# Altium schematic sheet HeaderA.SchDoc: HPBI Controller
size B; ApprovedBy: J Johnson; CheckedBy: J Johnson; Author: sdfasdfdfAEFfasdFfaF; DrawnBy: J Johnson; Organization: Opsero Electronic Design; Address1: 21-915 Av. Marguerite-Bourgeoys; Address2: Québec (QC); Address3: G1S 3X4; DocumentNumber: OP009-001-SCH; Revision: 1.0; SheetNumber: 09; SheetTotal: 16; Tel1: (581) 308-8830; Tel2: (581) 308-8830; Project: HPBI Controller; CheckedDate: yyyy-mm-dd; Sheet: Header A; PageSetup: Record=PageOptions|CenterHorizontal=True|CenterVertical=True|PrintScale=1.08|XCorrection=1.00|YCorrection=1.00|PrintKind=0|BorderSize=5000000|LeftOffset=0|BottomOffset=0|Orientation=2|PaperLength=1000|PaperWidth=1000|Scale=100|PaperSource=7|PrintQuality=-4|MediaType=1|DitherType=10|PaperKind=Tabloid     [11 x 17 in]|PrintScaleMode=1; DrawDate: 2013-12-13; SchTitle: HPBI Controller; RevDescription: Preliminary; RevDate: 2014-01-29; RevBy: J Johnson
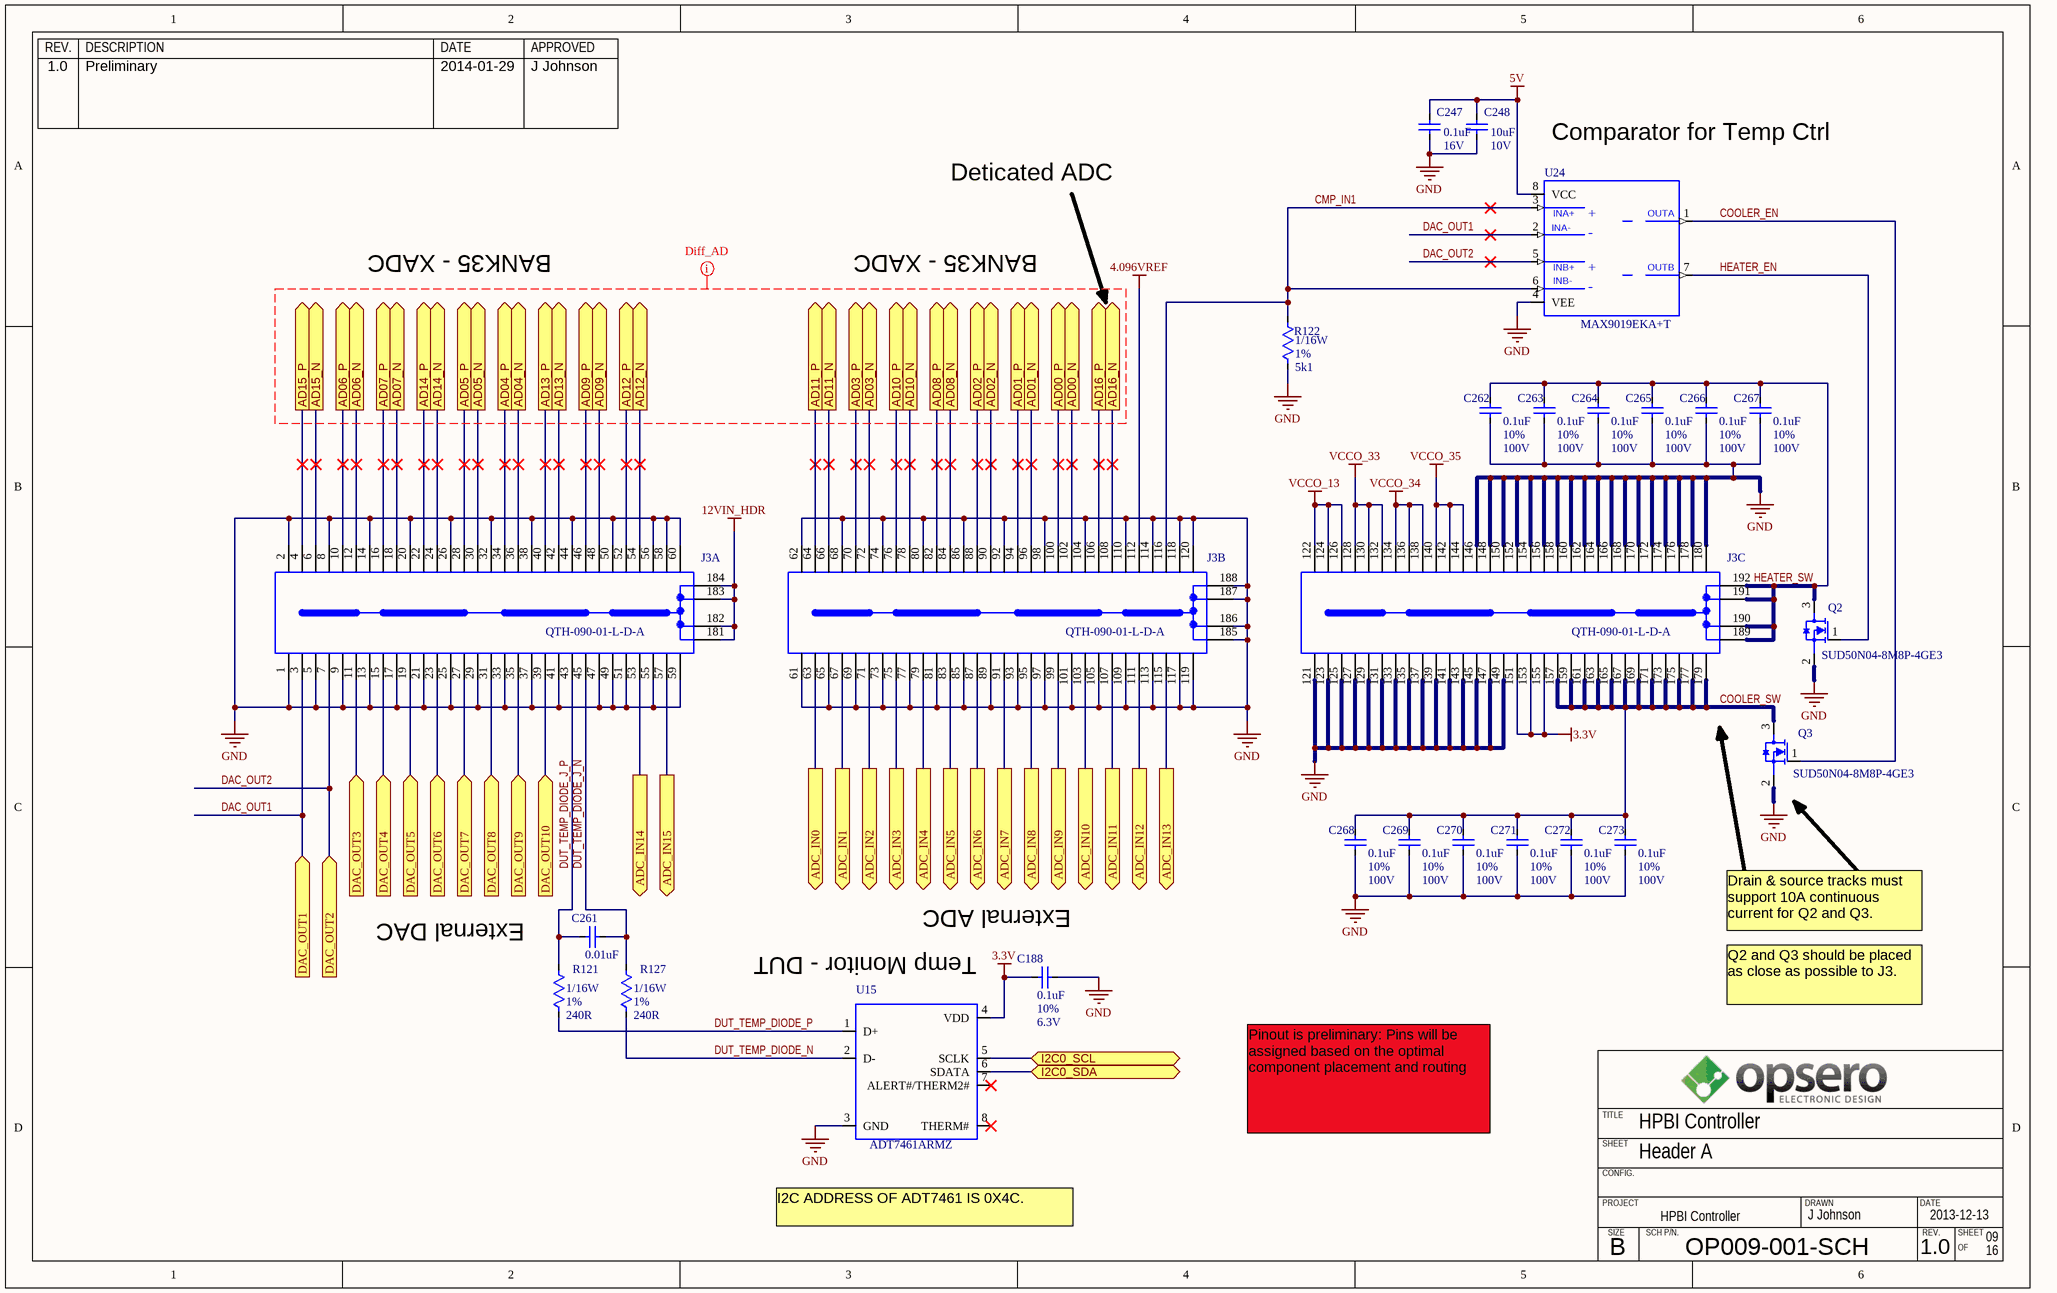
[diagram p0: HeaderA.SchDoc]

## Parts
C188  value 0.1uF  Tolerance: 10%  Voltage: 6.3V  [CAPC0603X33N]  (hidden comment: CAPACITOR_NP_TYPE1)
C247  value 0.1uF  Voltage: 16V  [CAPC1005X33N]  (hidden comment: CAPACITOR_NP_TYPE1)
C248  value 10uF  Voltage: 10V  [CAPC1608X38N]  (hidden comment: CAPACITOR_NP_TYPE1)
C261  value 0.01uF  [CAPC1005X33N]  (hidden comment: CAPACITOR_NP_TYPE1)
C262  value 0.1uF  Tolerance: 10%  Voltage: 100V  [CAPC1608X38N]  (hidden comment: CAPACITOR_NP_TYPE1)
C263  value 0.1uF  Tolerance: 10%  Voltage: 100V  [CAPC1608X38N]  (hidden comment: CAPACITOR_NP_TYPE1)
C264  value 0.1uF  Tolerance: 10%  Voltage: 100V  [CAPC1608X38N]  (hidden comment: CAPACITOR_NP_TYPE1)
C265  value 0.1uF  Tolerance: 10%  Voltage: 100V  [CAPC1608X38N]  (hidden comment: CAPACITOR_NP_TYPE1)
C266  value 0.1uF  Tolerance: 10%  Voltage: 100V  [CAPC1608X38N]  (hidden comment: CAPACITOR_NP_TYPE1)
C267  value 0.1uF  Tolerance: 10%  Voltage: 100V  [CAPC1608X38N]  (hidden comment: CAPACITOR_NP_TYPE1)
C268  value 0.1uF  Tolerance: 10%  Voltage: 100V  [CAPC1608X38N]  (hidden comment: CAPACITOR_NP_TYPE1)
C269  value 0.1uF  Tolerance: 10%  Voltage: 100V  [CAPC1608X38N]  (hidden comment: CAPACITOR_NP_TYPE1)
C270  value 0.1uF  Tolerance: 10%  Voltage: 100V  [CAPC1608X38N]  (hidden comment: CAPACITOR_NP_TYPE1)
C271  value 0.1uF  Tolerance: 10%  Voltage: 100V  [CAPC1608X38N]  (hidden comment: CAPACITOR_NP_TYPE1)
C272  value 0.1uF  Tolerance: 10%  Voltage: 100V  [CAPC1608X38N]  (hidden comment: CAPACITOR_NP_TYPE1)
C273  value 0.1uF  Tolerance: 10%  Voltage: 100V  [CAPC1608X38N]  (hidden comment: CAPACITOR_NP_TYPE1)
J3  QTH-090-01-L-D-A  [QTH-090-01-L-D-A]  (parts A,B,C of 3)
Q2  value SUD50N04-8M8P-4GE3  [TO228P1041X238-3N]  (hidden comment: TRANS_MOSFET_N-CH_TYPE2)
Q3  value SUD50N04-8M8P-4GE3  [TO228P1041X238-3N]  (hidden comment: TRANS_MOSFET_N-CH_TYPE2)
R121  value 240R  Power: 1/16W  Tolerance: 1%  [RESC1005X33N]  (hidden comment: *)
R122  value 5k1  Power: 1/16W  Tolerance: 1%  [RESC1005X33N]  (hidden comment: *)
R127  value 240R  Power: 1/16W  Tolerance: 1%  [RESC1005X33N]  (hidden comment: *)
U15  value ADT7461ARMZ  [SOP65P490X110-8N]  (hidden comment: ADT7461)
U24  value MAX9019EKA+T  [SOT65P280X145-8AN]  (hidden comment: MAX9019)

## Ports
AD00_N (out), AD00_P (out), AD01_N (out), AD01_P (out), AD02_N (out), AD02_P (out), AD03_N (out), AD03_P (out), AD04_N (out), AD04_P (out), AD05_N (out), AD05_P (out), AD06_N (out), AD06_P (out), AD07_N (out), AD07_P (out), AD08_N (out), AD08_P (out), AD09_N (out), AD09_P (out), AD10_N (out), AD10_P (out), AD11_N (out), AD11_P (out), AD12_N (out), AD12_P (out), AD13_N (out), AD13_P (out), AD14_N (out), AD14_P (out), AD15_N (out), AD15_P (out), AD16_N (out), AD16_P (out), ADC_IN0 (out), ADC_IN1 (out), ADC_IN2 (out), ADC_IN3 (out), ADC_IN4 (out), ADC_IN5 (out), ADC_IN6 (out), ADC_IN7 (out), ADC_IN8 (out), ADC_IN9 (out), ADC_IN10 (out), ADC_IN11 (out), ADC_IN12 (out), ADC_IN13 (out), ADC_IN14 (out), ADC_IN15 (out), DAC_OUT1 (in), DAC_OUT2 (in), DAC_OUT3 (in), DAC_OUT4 (in), DAC_OUT5 (in), DAC_OUT6 (in), DAC_OUT7 (in), DAC_OUT8 (in), DAC_OUT9 (in), DAC_OUT10 (in), I2C0_SCL (bidir), I2C0_SDA (bidir)

## Nets
3.3V: C188.1 J3.151 J3.153 J3.155 U15.4(VDD)
4.096VREF: J3.112
5V: C247.1 C248.1 U24.8(VCC)
12VIN_HDR: J3.181 J3.182 J3.183 J3.184
GND: C188.2 C247.2 C248.2 C262.2 C263.2 C264.2 C265.2 C266.2 C267.2 C268.2 C269.2 C270.2 C271.2 C272.2 C273.2 J3.1 J3.2 J3.5 J3.8 J3.9 J3.13 J3.14 J3.17 J3.20 J3.21 J3.25 J3.26 J3.29 J3.32 J3.33 J3.37 J3.38 J3.41 J3.44 J3.47 J3.49 J3.50 J3.51 J3.55 J3.56 J3.58 J3.59 J3.60 J3.61 J3.62 J3.65 J3.68 J3.69 J3.73 J3.74 J3.77 J3.80 J3.81 J3.85 J3.86 J3.89 J3.92 J3.93 J3.97 J3.98 J3.101 J3.104 J3.105 J3.109 J3.110 J3.113 J3.114 J3.117 J3.118 J3.119 J3.120 J3.121 J3.123 J3.125 J3.127 J3.129 J3.131 J3.133 J3.135 J3.137 J3.139 J3.141 J3.143 J3.145 J3.146 J3.147 J3.148 J3.149 J3.150 J3.152 J3.154 J3.156 J3.158 J3.160 J3.162 J3.164 J3.166 J3.168 J3.170 J3.172 J3.174 J3.176 J3.178 J3.180 J3.185 J3.186 J3.187 J3.188 Q2.2(S) Q3.2(S) R122.1 U15.3(GND) U24.4(VEE)
VCCO_13: J3.122 J3.124 J3.126
VCCO_33: J3.128 J3.130 J3.132
VCCO_34: J3.134 J3.136 J3.138
VCCO_35: J3.140 J3.142 J3.144
AD00_N: J3.102 ; port AD00_N
AD00_P: J3.100 ; port AD00_P
AD01_N: J3.96 ; port AD01_N
AD01_P: J3.94 ; port AD01_P
AD02_N: J3.90 ; port AD02_N
AD02_P: J3.88 ; port AD02_P
AD03_N: J3.72 ; port AD03_N
AD03_P: J3.70 ; port AD03_P
AD04_N: J3.36 ; port AD04_N
AD04_P: J3.34 ; port AD04_P
AD05_N: J3.30 ; port AD05_N
AD05_P: J3.28 ; port AD05_P
AD06_N: J3.12 ; port AD06_N
AD06_P: J3.10 ; port AD06_P
AD07_N: J3.18 ; port AD07_N
AD07_P: J3.16 ; port AD07_P
AD08_N: J3.84 ; port AD08_N
AD08_P: J3.82 ; port AD08_P
AD09_N: J3.48 ; port AD09_N
AD09_P: J3.46 ; port AD09_P
AD10_N: J3.78 ; port AD10_N
AD10_P: J3.76 ; port AD10_P
AD11_N: J3.66 ; port AD11_N
AD11_P: J3.64 ; port AD11_P
AD12_N: J3.54 ; port AD12_N
AD12_P: J3.52 ; port AD12_P
AD13_N: J3.42 ; port AD13_N
AD13_P: J3.40 ; port AD13_P
AD14_N: J3.24 ; port AD14_N
AD14_P: J3.22 ; port AD14_P
AD15_N: J3.6 ; port AD15_N
AD15_P: J3.4 ; port AD15_P
AD16_N: J3.108 ; port AD16_N
AD16_P: J3.106 ; port AD16_P
ADC_IN0: J3.63 ; port ADC_IN0
ADC_IN1: J3.67 ; port ADC_IN1
ADC_IN2: J3.71 ; port ADC_IN2
ADC_IN3: J3.75 ; port ADC_IN3
ADC_IN4: J3.79 ; port ADC_IN4
ADC_IN5: J3.83 ; port ADC_IN5
ADC_IN6: J3.87 ; port ADC_IN6
ADC_IN7: J3.91 ; port ADC_IN7
ADC_IN8: J3.95 ; port ADC_IN8
ADC_IN9: J3.99 ; port ADC_IN9
ADC_IN10: J3.103 ; port ADC_IN10
ADC_IN11: J3.107 ; port ADC_IN11
ADC_IN12: J3.111 ; port ADC_IN12
ADC_IN13: J3.115 ; port ADC_IN13
ADC_IN14: J3.53 ; port ADC_IN14
ADC_IN15: J3.57 ; port ADC_IN15
CMP_IN1: J3.116 R122.2 U24.3(INA+) U24.6(INB-)
COOLER_EN: Q3.1(G) U24.1(OUTA)
COOLER_SW: C268.1 C269.1 C270.1 C271.1 C272.1 C273.1 J3.157 J3.159 J3.161 J3.163 J3.165 J3.167 J3.169 J3.171 J3.173 J3.175 J3.177 J3.179 Q3.3(D)
DAC_OUT1: J3.3 U24.2(INA-) ; port DAC_OUT1
DAC_OUT2: J3.7 U24.5(INB+) ; port DAC_OUT2
DAC_OUT3: J3.11 ; port DAC_OUT3
DAC_OUT4: J3.15 ; port DAC_OUT4
DAC_OUT5: J3.19 ; port DAC_OUT5
DAC_OUT6: J3.23 ; port DAC_OUT6
DAC_OUT7: J3.27 ; port DAC_OUT7
DAC_OUT8: J3.31 ; port DAC_OUT8
DAC_OUT9: J3.35 ; port DAC_OUT9
DAC_OUT10: J3.39 ; port DAC_OUT10
DUT_TEMP_DIODE_J_N: C261.2 J3.45 R127.2
DUT_TEMP_DIODE_J_P: C261.1 J3.43 R121.2
DUT_TEMP_DIODE_N: R127.1 U15.2(D-)
DUT_TEMP_DIODE_P: R121.1 U15.1(D+)
HEATER_EN: Q2.1(G) U24.7(OUTB)
HEATER_SW: C262.1 C263.1 C264.1 C265.1 C266.1 C267.1 J3.189 J3.190 J3.191 J3.192 Q2.3(D)
I2C0_SCL: U15.5(SCLK) ; port I2C0_SCL
I2C0_SDA: U15.6(SDATA) ; port I2C0_SDA

Not connected (* = marked no-connect by the designer): U15 7(ALERT#/THERM2#)* 8(THERM#)*

## Layout directives
net class Diff_AD: (no net found under the mark)

## Notes on the sheet
- Comparator for Temp Ctrl
- Deticated ADC
- BANK35 - XADC
- External DAC
- (near C188) External ADC
- Temp Monitor - DUT
- Drain & source tracks must support 10A continuous current for Q2 and Q3.
- Q2 and Q3 should be placed as close as possible to J3.
- Pinout is preliminary: Pins will be assigned based on the optimal component placement and routing
- I2C ADDRESS OF ADT7461 IS 0X4C.
- REV.
- DESCRIPTION
- DATE
- APPROVED
- SHEET
- TITLE
- CONFIG.
- PROJECT
- SIZE
- SCH P/N.
- DRAWN
- B
- OF
- (in symbol MAX9019EKA+T) +; -

## Library data of the parts
C188 = C0201_0.1uF_10%_6.3V_X5R: Capacitor ceramic, X5R, 0.1uF, 6.3V, 10%, -55 to +125 C, EIA0201; Manufacturer 1: Murata; Mfg Part Number 1: GRM033R60J104KE19D; EIA(I) Package: 0201; EIA(M) Package: 0603; ASSY: USED; Status: Active; Power: *; Current: *; Part Ref: C0201_0.1uF_10%_6.3V_X5R; Comment_1: *; RoHs: True; Operating Temp: -55 to +85 C
C247 = C0402_0.1uF_10%_16V_X7R: Capacitor ceramic, X7R, 0.1uF, 16V, 10%, -55 to +125 C, EIA0402; Manufacturer 1: Murata; Mfg Part Number 1: GRM155R71C104KA88D; EIA(I) Package: 0402; EIA(M) Package: 1005; ASSY: USED; Status: Active; Power: *; Current: *; Part Ref: C0402_0.1uF_10%_16V_X7R; Comment_1: *; RoHs: True; Tolerance: 10%; Operating Temp: -55 to +125 C; Datasheet 1: ..\datasheet\Capacitor\Murata\GRM_Serie\GRM188R72A_X7R\2012-06-24
C248 = C0603_10uF_10%_10V_X5R: Capacitor ceramic, X5R, 10uF, 10V, 10%, -55 to +85 C, EIA0603; Manufacturer 1: TDK Corporation; Mfg Part Number 1: C1608X5R1A106K080AC; EIA(I) Package: 0603; EIA(M) Package: 1608; ASSY: USED; Status: Active; Power: *; Current: *; Part Ref: C0603_10uF_10%_10V_X5R; Comment_1: *; RoHs: True; Tolerance: 10%; Operating Temp: -55 to +85 C
C261 = C0402_0.01uF_10%_50V_X7R: Capacitor ceramic, X7R, 0.01uF, 50V, 10%, -55 to +125 C, EIA0402; Manufacturer 1: Murata; Mfg Part Number 1: GRM155R71H103KA88D; EIA(I) Package: 0402; EIA(M) Package: 1005; ASSY: USED; Status: Active; Power: *; Current: *; Part Ref: C0402_0.01uF_10%_50V_X7R; Comment_1: *; RoHs: True; Tolerance: 10%; Voltage: 50V; Operating Temp: -55 to +125 C; Datasheet 1: ..\datasheet\Capacitor\Murata\GRM_Serie\GRM155R71H103KA88D\2013-04-08
C262-C273 = C0603_0.1uF_10%_100V_X7R: Capacitor ceramic, X7R, 0.1uF, 100V, 10%, -55 to +125 C, EIA0603; Manufacturer 1: Murata; Mfg Part Number 1: GRM188R72A104KA35D; EIA(I) Package: 0603; EIA(M) Package: 1608; ASSY: USED; Status: Active; Power: *; Current: *; Part Ref: C0603_0.1uF_10%_100V_X7R; Comment_1: *; RoHs: True; Operating Temp: -55 to +125 C; Datasheet 1: ..\datasheet\Capacitor\Murata\GRM_Serie\GRM188R72A_X7R\2012-06-24
J3 = QTH-090-01-L-D-A: Connector Header HS .5mm 180 pin DL AU; Manufacturer 1: Samtec; PART NUMBER: QTH-090-01-L-D-A; Part Ref: QTH-090-01-L-D-A; RoHs: True; Value: QTH-090-01-L-D-A; Mfg Part Number 1: QTH-090-01-L-D-A
Q2 Q3 = SUD50N04-8M8P-4GE3: Transistor MOSFET, N-Channel, 40V, 50A, -55 to +150 C, 48W, TO-252; Manufacturer 1: Vishay; ASSY: USED; Comment_1: Com; Status: Active; EIA(I) Package: *; EIA(M) Package: *; Part Ref: SUD50N04-8M8P-4GE3; Power: 48W; Current: 50A; Tolerance: *; Voltage: 40V; Package: TO-263; RoHs: True; Operating Temp: -55 to +150 C; Mfg Part Number 1: SUD50N04-8M8P-4GE3
R121 R127 = R0402_240R_1%: Resistor, 240R, 1/16W, 1%, -50 to +155 C, EIA0402, EIA(M)1005; Manufacturer 1: Vishay Dale; Mfg Part Number 1: CRCW0402240RFKED; EIA(I) Package: 0402; EIA(M) Package: 1005; Voltage: 50V; ASSY: USED; Status: Active; Part Ref: R0402_240R_1%; Current: *; Comment_1: *; RoHs: True; Operating Temp: -50 to +155 C
R122 = R0402_5k10_1%: Resistor, 5k10, 1/16W, 1%, -50 to +155 C, EIA0402, EIA(M)1005; Manufacturer 1: Yageo; Mfg Part Number 1: RC0402FR-075k1L; EIA(I) Package: 0402; EIA(M) Package: 1005; Voltage: 50V; ASSY: USED; Status: Active; Part Ref: R0402_5k10_1%; Current: *; Comment_1: *; RoHs: True; Operating Temp: -50 to +155 C; Datasheet 1: ..\datasheet\Resistor\Yaego\Thick_Film\RC0402\2012-03-29; Manufacturer 2: Vishay Dale; Mfg Part Number 2: CRCW04025k10FKED; Datasheet 2: ..\datasheet\Resistor\Vishay Dale\CRC\2012-03-29
U15 = ADT7461ARMZ: Temperature monitor 1C, MSOP8; Manufacturer 1: ON Semiconductor; ASSY: USED; Power: Pow; Current: Cur; Voltage: Vol; Comment_1: Com; Status: Active; EIA(I) Package: *; EIA(M) Package: *; Part Ref: ADT7461ARMZ; Tolerance: *; Package: MSOP8; RoHs: True; Mfg Part Number 1: ADT7461ARMZ
U24 = MAX9019EKA+T: Comparator, Dual, Push-pull, 1.8V to 5.5V, 50mA, -40 to +85 C, , SOT-23-8; Manufacturer 1: Maxim; ASSY: USED; Power: Pow; Comment_1: Com; Status: Active; EIA(I) Package: *; EIA(M) Package: *; Part Ref: MAX9019EKA+T; Current: 50mA; Tolerance: *; Voltage: 1.8V to 5.5V; Package: SOT-23-8; RoHs: True; Operating Temp: -40 to +85 C; Mfg Part Number 1: MAX9019EKA+T